# Altium schematic sheet LVBMSBQF schematic.SchDoc
size A4; SheetNumber: 1; SheetTotal: 3
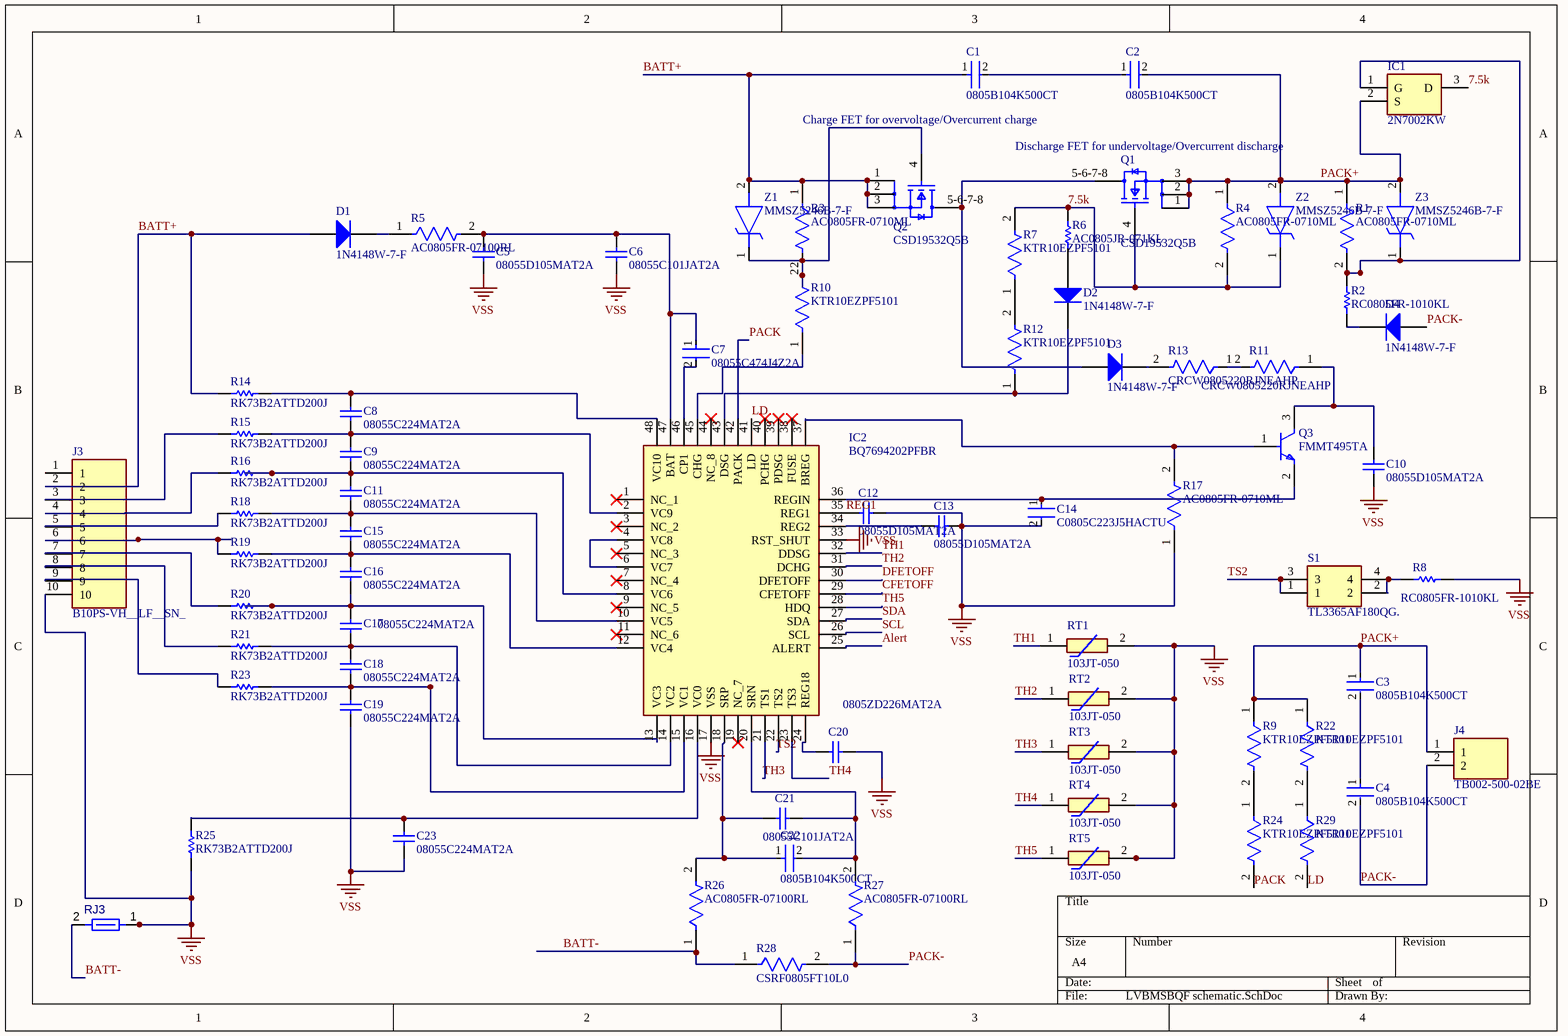
[diagram p0: LVBMSBQF schematic.SchDoc]

## Parts
C1  0805B104K500CT  [FP-0805B-IPC_C]
C2  0805B104K500CT  [FP-0805B-IPC_C]
C3  0805B104K500CT  [FP-0805B-IPC_C]
C4  0805B104K500CT  [FP-0805B-IPC_C]
C5  08055D105MAT2A  [CAPC2013X152X50ML20T25]
C6  08055C101JAT2A  [CAPC2013X94X50NL20T25]
C7  08055C474J4Z2A  [FP-0805-L_2_01_0_2-W_1_25-IPC_B]
C8  08055C224MAT2A  [CAPC2013X140X50NL20T25]
C9  08055C224MAT2A  [CAPC2013X140X50NL20T25]
C10  08055D105MAT2A  [CAPC2013X152X50ML20T25]
C11  08055C224MAT2A  [CAPC2013X140X50NL20T25]
C12  08055D105MAT2A  [CAPC2013X152X50ML20T25]
C13  08055D105MAT2A  [CAPC2013X152X50ML20T25]
C14  C0805C223J5HACTU  [FP-C0805C-DN-MFG]
C15  08055C224MAT2A  [CAPC2013X140X50NL20T25]
C16  08055C224MAT2A  [CAPC2013X140X50NL20T25]
C17  08055C224MAT2A  [CAPC2013X140X50NL20T25]
C18  08055C224MAT2A  [CAPC2013X140X50NL20T25]
C19  08055C224MAT2A  [CAPC2013X140X50NL20T25]
C20  0805ZD226MAT2A  [CAPC2013X152X50ML20T25]
C21  08055C101JAT2A  [CAPC2013X94X50NL20T25]
C22  0805B104K500CT  [FP-0805B-IPC_C]
C23  08055C224MAT2A  [CAPC2013X140X50NL20T25]
D1  1N4148W-7-F  [DIOD-SOD123-2_V]
D2  1N4148W-7-F  [DIOD-SOD123-2_V]
D3  1N4148W-7-F  [DIOD-SOD123-2_V]
D4  1N4148W-7-F  [DIOD-SOD123-2_V]
IC1  2N7002KW  [SOT65P210X110-3N]
IC2  BQ7694202PFBR  [QFP50P900X900X120-48N]
J3  B10PS-VH__LF__SN_  [B10PSVHLFSN]
J4  TB002-500-02BE  [TB00250002BE]
Q1  CSD19532Q5B  [FP-DNK0008A-MFG]
Q2  CSD19532Q5B  [FP-DNK0008A-MFG]
Q3  FMMT495TA  [FP-SOT23-MFG]
R1  AC0805FR-0710ML  [FP-AC0805-MFG]
R2  RC0805FR-1010KL  [RESC2013X60X35LL10T20]
R3  AC0805FR-0710ML  [FP-AC0805-MFG]
R4  AC0805FR-0710ML  [FP-AC0805-MFG]
R5  AC0805FR-07100RL  [FP-AC0805-MFG]
R6  AC0805JR-071KL  [RESC2013X60X35LL10T20]
R7  KTR10EZPF5101  [FP-KTR10-MFG]
R8  RC0805FR-1010KL  [RESC2013X60X35LL10T20]
R9  KTR10EZPF5101  [FP-KTR10-MFG]
R10  KTR10EZPF5101  [FP-KTR10-MFG]
R11  CRCW0805220RJNEAHP  [FP-CRCW0805-HPe3-IPC_A]
R12  KTR10EZPF5101  [FP-KTR10-MFG]
R13  CRCW0805220RJNEAHP  [FP-CRCW0805-HPe3-IPC_A]
R14  RK73B2ATTD200J  [RESC2013X60X30ML20T20]
R15  RK73B2ATTD200J  [RESC2013X60X30ML20T20]
R16  RK73B2ATTD200J  [RESC2013X60X30ML20T20]
R17  AC0805FR-0710ML  [FP-AC0805-MFG]
R18  RK73B2ATTD200J  [RESC2013X60X30ML20T20]
R19  RK73B2ATTD200J  [RESC2013X60X30ML20T20]
R20  RK73B2ATTD200J  [RESC2013X60X30ML20T20]
R21  RK73B2ATTD200J  [RESC2013X60X30ML20T20]
R22  KTR10EZPF5101  [FP-KTR10-MFG]
R23  RK73B2ATTD200J  [RESC2013X60X30ML20T20]
R24  KTR10EZPF5101  [FP-KTR10-MFG]
R25  RK73B2ATTD200J  [RESC2013X60X30ML20T20]
R26  AC0805FR-07100RL  [FP-AC0805-MFG]
R27  AC0805FR-07100RL  [FP-AC0805-MFG]
R28  CSRF0805FT10L0  [FP-CSRF0805-IPC_A]
R29  KTR10EZPF5101  [FP-KTR10-MFG]
RJ3  Net Tie 0.6x1.4mm  [SHORT10_8MIL-FP]  (value not drawn)  (net tie, no BOM)
RT1  103JT-050  [103JT050]
RT2  103JT-050  [103JT050]
RT3  103JT-050  [103JT050]
RT4  103JT-050  [103JT050]
RT5  103JT-050  [103JT050]
S1  TL3365AF180QG.  [TL3365AF180QG]
Z1  MMSZ5246B-7-F  [SOD3716X145N]
Z2  MMSZ5246B-7-F  [SOD3716X145N]
Z3  MMSZ5246B-7-F  [SOD3716X145N]

## Nets
VSS: C5.1 C6.1 C10.1 C12.2 C13.2 C14.2 C19.1 C20.2 C23.1 IC2.17(VSS) IC2.33(RST_SHUT) J3.10 R8.1 R17.1 R25.1 RJ3.1 RT1.2 RT2.2 RT3.2 RT4.2 RT5.2
7.5k: IC1.3(D) Q1.4(G) R4.2 R6.2 R7.2 Z2.1(K)
Alert: IC2.25(ALERT)
BATT+: C1.1 D1.1(A) J3.2 Q2.1(S) Q2.2(S) Q2.3(S) R3.1 R14.1 Z1.2(A)
BATT-: R26.1 R28.1 RJ3.2
CFETOFF: IC2.29(CFETOFF)
DFETOFF: IC2.30(DFETOFF)
LD: IC2.41(LD) R29.2
PACK: IC2.42(PACK) R24.2
PACK+: C2.2 C3.1 IC1.2(S) J4.1 Q1.1(S) Q1.2(S) Q1.3(S) R1.1 R4.1 R9.1 R22.1 Z2.2(A) Z3.2(A)
PACK-: C4.2 D4.1(A) J4.2 R27.1 R28.2
REG1: C12.1 IC2.35(REG1)
SCL: IC2.26(SCL)
SDA: IC2.27(SDA)
TH1: IC2.32(DDSG) RT1.1
TH2: IC2.31(DCHG) RT2.1
TH3: IC2.21(TS1) RT3.1
TH4: IC2.23(TS3) RT4.1
TH5: IC2.28(HDQ) RT5.1
TS2: IC2.22(TS2) S1.1 S1.3
NetC1_2: C1.2 C2.1
NetC3_2: C3.2 C4.1
NetC5_2: C5.2 C6.2 C7.1 IC2.47(BAT) R5.2
NetC7_2: C7.2 IC2.46(CP1)
NetC8_1: C8.1 C9.2 IC2.2(VC9) R15.2
NetC8_2: C8.2 IC2.48(VC10) R14.2
NetC10_2: C10.2 Q3.3(C) R11.1
NetC11_1: C11.1 C15.2 IC2.10(VC5) R18.2
NetC11_2: C11.2 IC2.8(VC6) R16.2
NetC13_1: C13.1 IC2.34(REG2)
NetC14_1: C14.1 IC2.36(REGIN) Q3.2(E)
NetC15_1: C15.1 C16.2 IC2.12(VC4) R19.2
NetC16_1: C16.1 C17.2 IC2.13(VC3) R20.2
NetC17_1: C17.1 C18.2 IC2.14(VC2) R21.2
NetC18_1: C18.1 C19.2 IC2.15(VC1) R23.2
NetC20_1: C20.1 IC2.24(REG18)
NetC21_1: C21.1 C22.2 IC2.20(SRN) R27.2
NetC21_2: C21.2 C22.1 IC2.18(SRP) R26.2
NetC23_2: C23.2 IC2.16(VC0) R25.2
NetD1_2: D1.2(K) R5.1
NetD2_1: D2.1(A) R6.1
NetD2_2: D2.2(K) IC2.43(DSG) R12.1
NetD3_1: D3.1(A) Q1.5-6-7-8(D) Q2.5-6-7-8(D)
NetD3_2: D3.2(K) R13.2
NetD4_2: D4.2(K) R2.2
NetIC1_1: IC1.1(G) R1.2 R2.1 Z3.1(K)
NetIC2_4: IC2.4(VC8) IC2.6(VC7)
NetIC2_37: IC2.37(BREG) Q3.1(B) R17.2
NetIC2_45: IC2.45(CHG) R10.1
NetJ3_3: J3.3 R15.1
NetJ3_4: J3.4 R16.1
NetJ3_5: J3.5 R18.1
NetJ3_6: J3.6 R19.1
NetJ3_7: J3.7 R20.1
NetJ3_8: J3.8 R21.1
NetJ3_9: J3.9 R23.1
NetQ2_4: Q2.4(G) R3.2 R10.2 Z1.1(K)
NetR7_1: R7.1 R12.2
NetR8_2: R8.2 S1.2 S1.4
NetR9_2: R9.2 R24.1
NetR11_2: R11.2 R13.1
NetR22_2: R22.2 R29.1

Not connected (* = marked no-connect by the designer): C9 1; IC2 1(NC_1)* 3(NC_2)* 5(NC_3)* 7(NC_4)* 9(NC_5)* 11(NC_6)* 19(NC_7)* 38(FUSE)* 39(PDSG)* 40(PCHG)* 44(NC_8)*; J3 1

## Notes on the sheet
- Charge FET for overvoltage/Overcurrent charge
- Discharge FET for undervoltage/Overcurrent discharge

## Library data of the parts
C1-C4 C22 = CMP-45632-000003-1: CAP CER 0.1UF 50V X7R 0805; Capacitance: 100nF; Tolerance: 10%; RoHS Compliant: Yes; Packaging: Tape and Reel; Voltage Rating (DC): 50V; Voltage Rating: 50V; Length: 2mm; Lead Free: Lead Free; Voltage: 50V; Case/Package: 0805; Case Code (Metric): 2012; Depth: 1.25mm; Min Operating Temperature: -55°C; Case Code (Imperial): 0805; Max Operating Temperature: 125°C; Radiation Hardening: No; Dielectric: X7R
C5 C10 C12 C13 = CMP-1036-04764-2
C6 C21 = CMP-2007-04356-1
C7 = CMP-04427-003155-1: Automotive Ceramic Capacitor, 0805, 470nF, 5%, X7R, 15%, 50V; Dielectric: X7R; Depth: 1.25mm; Max Operating Temperature: 125°C; Mount: Surface Mount; Radiation Hardening: No; Capacitance: 470nF; Construction: Flat; Packaging: Tape and Reel; Min Operating Temperature: -55°C; Length: 2.01mm; RoHS Compliant: Yes; Voltage Rating (DC): 50V; Case/Package: 0805; Tolerance: 5%; Package Quantity: 2000
C8 C9 C11 C15-C19 C23 = CMP-2007-04632-1
C14 = CMP-2007-03639-2: CAP CER 0.022UF 50V X8R 0805; Tolerance: 0.05; Capacitance: 22,000 pF; Material: Ceramic; Temperature Coefficient: 30ppm/°C; Value: 22,000 pF; ComponentLink2Description: Datasheet; Package: C0805C-DN; Category: Cap; Voltage Rating: 50 V; Lead Free: Yes; Height: 0.88mm; Temperature Characteristic: X8R; Mouser Description: Multilayer Ceramic Capacitors MLCC - SMD/SMT 50V 22000pF +/-5% X8R; Temperature Range High: +125°C; Ipc Land Pattern Name: CAPC200125X78; Automotive: No; Temperature: -55°C to +125°C; Temperature Range Low: -55°C; Octopart: https://octopart.com/c0805c223j5hactu-kemet-18638969; Device Class L1: Passive Components; RoHS: TRUE; Device Class L2: Capacitors; Device Class L3: Ceramic Capacitors; ComponentLink2URL: https://content.kemet.com/datasheets/KEM_C1003_C0G_SMD.pdf; Digikey Description: CAP CER 0.022UF 50V X8R 0805
C20 = CMP-2007-04522-1
D1-D4 = CMP-2000-04932-2: Fast Switching Diode, 100 V, 0.15 A, -65 to 150 degC, 2-Pin?SOD123, RoHS, Tape and Reel; Recovery Time: 4ns; Brand: DiodesIncorporated; Unit Weight: 0.000353oz; Max Surge Current: 2A; Peak Reverse Voltage: 100V; Ir - Reverse Current: 1uA; Vf - Forward Voltage: 1.25V; Configuration: Single; If - Forward Current: 0.15A; Product Category: Diodes-GeneralPurpose,Power,Switching; Operating Temperature Range: -65Cto+150C; Packaging: Reel; Manufacturer URL: http://www.diodes.com/; Maximum Operating Temperature: +150C; Height: 1.25mm; Minimum Operating Temperature: -65C; Product: SwitchingDiodes; Package URL: http://www.diodes.com/datasheets/ds18004.pdf; Type: SwitchingDiode; Package Reference: SOD123-2; Width: 1.7mm; Datasheet URL: http://www.farnell.com/datasheets/1915529.pdf; Datasheet Version: Rev. 24-2, 10/2013; Series: 1N4148; Factory Pack Quantity: 3000; Length: 2.85mm; RoHS: True; Mounting Style: SMD/SMT; Package / Case: SOD-123
  D4: Manufacturer: DiodesIncorporated
IC1 = 2N7002KW: Integrated Circuit; Manufacturer_Name: onsemi; Datasheet Link: https://www.onsemi.com/pub/Collateral/2N7002KW-D.PDF; Height: 1.1mm; Manufacturer_Part_Number: 2N7002KW; Mouser Part Number: 512-2N7002KW; Mouser Price/Stock: https://www.mouser.co.uk/ProductDetail/onsemi-Fairchild/2N7002KW?qs=1%252BQrTMB6OPVOqkaNo2cdQQ%3D%3D; Arrow Part Number: 2N7002KW; Arrow Price/Stock: https://www.arrow.com/en/products/2n7002kw/on-semiconductor.html?utm_currency=USD&region=nac
IC2 = BQ7694202PFBR: Integrated Circuit; Datasheet Link: https://www.ti.com/lit/ds/symlink/bq76942.pdf?ts=1642500793238&ref_url=https%253A%252F%252Fwww.ti.com%252Fproduct%252FBQ76942; Height: 1.2mm; Manufacturer_Part_Number: BQ7694202PFBR; Mouser Part Number: 595-BQ7694202PFBR; Mouser Price/Stock: https://www.mouser.co.uk/ProductDetail/Texas-Instruments/BQ7694202PFBR?qs=iLbezkQI%252BshAVl2BMDVCMQ%3D%3D; Arrow Part Number: BQ7694202PFBR; Arrow Price/Stock: https://www.arrow.com/en/products/bq7694202pfbr/texas-instruments?utm_currency=USD&region=nac
J3 = B10PS-VH__LF__SN_: Connector; Manufacturer_Part_Number: B10PS-VH (LF)(SN); Datasheet Link: https://www.marutsu.co.jp/contents/shop/marutsu/datasheet/VH.pdf; Height: 8.5mm; Arrow Part Number: B10PS-VH (LF)(SN); Arrow Price/Stock: https://www.arrow.com/en/products/b10ps-vh-lf-sn/jst-manufacturing?region=nac
J4 = TB002-500-02BE: Connector; Manufacturer_Name: Same Sky; Datasheet Link: https://www.sameskydevices.com/product/resource/tb002-500.pdf; Height: 10.4mm; Manufacturer_Part_Number: TB002-500-02BE; Mouser Part Number: 490-TB002-500-02BE; Mouser Price/Stock: https://www.mouser.co.uk/ProductDetail/Same-Sky/TB002-500-02BE?qs=vLWxofP3U2x9716kcgva%2Fw%3D%3D; Arrow Part Number: TB002-500-02BE; Arrow Price/Stock: https://www.arrow.com/en/products/tb002-500-02be/cui-devices.html?utm_currency=USD&region=nac
Q1 Q2 = CMP-04962-000007-1: MOSFET N-CH 100V 100A 8SON; Depletion Mode: False; Number Of Channels: 1; Gate To Source Voltage: 20V; Reverse Recovery Time: 80ns; Input Capacitace At Vds: 3700pF @ 50V; Max Forward Diode Voltage: 1V; Turn Off Delay Time: 22ns; Drain To Source Resistance: 4.6mΩ; Threshold Vgs Max: 3.2V; Max Junction Temp: +150°C; Turn On Delay Time: 7ns; Pulse Drain Current: 400A; Rthja Max: 50°C/W; Typ Forward Diode Voltage: 0.8V; Reverse Recovery Charge: 249nC; Threshold Vgs Min: 2.2V; Gate Charge At Vgs: 48nC @ 10V; Power Dissipation: 3.1W; Transconductance: 84S; Temperature Range Low: -55°C; Automotive: No; RoHS: TRUE; Temperature: -55°C to +150°C; Device Class L3: MOSFETs; Continuous Drain Current: 100A; Number Of N Channels: 1; Height: 1.05mm; Mouser Description: MOSFET 100V 4.0 mOhm N-Ch NexFET Power MOSFET; Drain To Source Voltage: 100V; Temperature Range High: +150°C; Octopart: https://octopart.com/csd19532q5b-texas+instruments-32890191; ComponentLink2URL: http://www.ti.com/lit/ds/symlink/csd19532q5b.pdf; Lead Free: Yes; Drain To Source Breakdown Voltage: 100V; Device Class L1: Discrete Semiconductors; Device Class L2: Transistors; Package: DNK0008A; Digikey Description: MOSFET N-CH 100V 100A 8SON; Category: Trans; ComponentLink2Description: Datasheet
Q3 = CMP-12798-000005-1: TRANS NPN 150V 1A SOT23-3; Hfe Max: 300; Power Dissipation: 500mW; Unity Gain Freq: 100MHz; Collector Emitter Saturation Voltage: 0.3V; Number Of Elements: 1; Collector Base Voltage: 170V; Hfe Min: 100; Automotive Grade: Grade 0; Hfe Testvce: 10V; Max Junction Temp: +150°C; Rthja Max: 250°C/W; Hfe Testic: 250mA; Standoff Height: 0.013mm; Emitter Base Voltage: 7V; ComponentLink2Description: Datasheet; Package: SOT23; Device Class L2: Transistors; Lead Free: Yes; Height: 1.1mm; Automotive: Yes; Digikey Description: TRANS NPN 150V 1A SOT23-3; Max Collector Current: 1A; Mouser Description: Bipolar Transistors - BJT NPN High Voltage; Collector Emitter Voltage: 150V; Footprint Url: https://www.diodes.com/assets/Package-Files/SOT23.pdf; ComponentLink2URL: https://www.diodes.com/assets/Datasheets/FMMT495.pdf; Temperature: -55°C to +150°C; Number Of Npn: 1; RoHS: TRUE; Collector Emitter Breakdown Voltage: 150V; Category: Trans; Device Class L3: BJTs; Octopart: https://octopart.com/fmmt495ta-diodes+inc.-356348; Device Class L1: Discrete Semiconductors; Temperature Range High: +150°C; Temperature Range Low: -55°C
R1 R3 R4 R17 = CMP-03412-037628-1: RES SMD 10M OHM 1% 1/8W 0805; Automotive Grade: Grade 0; Voltage Rating: 150V; Value: 10MΩ; Tolerance: 0.01; Device Class L2: Resistors; Device Class L3: Chip SMD Resistors; Package: AC0805; Lead Free: Yes; Series: AC; Automotive: Yes; Composition: Thick Film; Temperature: -55°C to +155°C; Resistance: 10MΩ; Octopart: https://octopart.com/ac0805fr-0710ml-yageo-71367525; Height: 0.6mm; Power Rating: 1/8W; Temperature Range Low: -55°C; Category: Res; Ipc Land Pattern Name: RESC200125X50; Digikey Description: RES SMD 10M OHM 1% 1/8W 0805; Device Class L1: Passive Components; RoHS: TRUE; ComponentLink2URL: http://www.yageo.com/documents/recent/PYu-AC_51_RoHS_L_6.pdf; ComponentLink2Description: Datasheet; Footprint Url: http://www.yageo.com/exep/pages/download/literatures/PYu-R_Mount_10.pdf; Temperature Range High: +155°C
R2 R8 = CMP-2001-04512-1
R5 R26 R27 = CMP-03412-037503-1: Res Thick Film 0805 100 Ohm 1% 1/8W ±100ppm/°C Molded SMD Paper T/R; Voltage Rating: 150V; Tolerance: 0.01; Automotive Grade: Grade 0; Resistance: 100Ω; Value: 100Ω; Package: AC0805; ComponentLink2URL: http://www.yageo.com/documents/recent/PYu-AC_51_RoHS_L_6.pdf; Device Class L2: Resistors; Mouser Description: Thick Film Resistors 1/8W 100ohm 1% AEC-Q200; Footprint Url: http://www.yageo.com/exep/pages/download/literatures/PYu-R_Mount_10.pdf; Temperature Range Low: -55°C; Temperature: -55°C to +155°C; ComponentLink2Description: Datasheet; RoHS: TRUE; Category: Res; Ipc Land Pattern Name: RESC200125X50; Temperature Range High: +155°C; Composition: Thick Film; Octopart: https://octopart.com/ac0805fr-07100rl-yageo-24517276; Device Class L3: Chip SMD Resistors; Height: 0.6mm; Automotive: Yes; Digikey Description: Res Thick Film 0805 100 Ohm 1% 1/8W ±100ppm/°C Molded SMD Paper T/R; Series: AC; Lead Free: Yes; Power Rating: 1/8W; Device Class L1: Passive Components
R6 = CMP-2001-04511-1
R7 R9 R10 R12 R22 R24 R29 = CMP-08839-031572-1: Res Thick Film 0805 5.1kΩ 1% 0.125W ±100ppm/°C Automotive Paper T/R; Max Power Dissipation: 125mW; Resistance: 5.1kR; Number of Terminations: 2; Features: Automotive AEC-Q200; Height: 0.026inch; Length: 0.079inch; Case/Package: 0805; Packaging: Tape and Reel; Case Code (Imperial): 0805; Min Operating Temperature: -55°C; Tolerance: 1%; Width: 0.049inch; Max Operating Temperature: 155°C; Resistor Type: Thick Film; Temperature Coefficient: 100ppm/°C; Series: KTR; Package Quantity: 5000; Case Code (Metric): 2012; RoHS Compliant: Yes
R11 R13 = CMP-02407-005533-1: RES Thick Film, 220Ω, 5%, 0.5W, 200ppm/°C, 0805; Power Rating: 500mW; Resistance: 220R; Voltage Rating: 150V; Max Power Dissipation: 333mW; Max Operating Temperature: 155°C; Tolerance: 5%; Features: Automotive AEC-Q200; Case Code (Imperial): 0805; Height: 0.024inch; Length: 0.079inch; Lead Free: Lead Free; Case Code (Metric): 2012; Temperature Coefficient: 200ppm/°C; Packaging: Tape and Reel; Case/Package: 0805; Package Quantity: 1; Contact Plating: Tin; Radiation Hardening: No; Number of Terminations: 2; Termination: SMD/SMT; Weight: 0.000194oz; Width: 0.049inch; Min Operating Temperature: -55°C; Composition: Thick Film
R14-R16 R18-R21 R23 R25 = CMP-2001-01797-1
R28 = CMP-26527-002472-1: Foil on Ceramic Current Sensing Chip Resistor 10 mΩ ±1% 0.5W 0805 AEC Qualified; Temperature Coefficient: 100ppm/°C; Max Power Dissipation: 500mW; Resistance: 10mR; Max Operating Temperature: 170°C; RoHS Compliant: Yes; Number of Terminations: 2; Case/Package: 0805; Radiation Hardening: No; Series: CSRF; Height: 0.031inch; Lead Free: Lead Free; Length: 0.079inch; Min Operating Temperature: -55°C; Case Code (Imperial): 0805; Resistor Type: Metal Foil; Features: Moisture Resistant; Mount: Surface Mount; Contact Plating: Tin; Tolerance: 1%; Width: 0.049inch; Case Code (Metric): 2012; Packaging: Tape and Reel
RJ3 = CMP-009-00120-2: Max Operating Temperature: 155°C; Min Operating Temperature: -55°C; Pins: 2
RT1-RT5 = 103JT-050: Thermistor; Manufacturer_Name: Semitec; Datasheet Link: https://componentsearchengine.com/Datasheets/1/103JT-050.pdf; Height: 46mm; Manufacturer_Part_Number: 103JT-050; Mouser Part Number: 954-103JT-050; Mouser Price/Stock: https://www.mouser.co.uk/ProductDetail/Semitec/103JT-050?qs=wgO0AD0o1vtVkR4pf7Ll0w%3D%3D
S1 = TL3365AF180QG.: Switch; Datasheet Link: https://sten-eswitch-13110800-production.s3.amazonaws.com/system/asset/product_line/data_sheet/218/TL3365.pdf; Height: 2.5mm; Manufacturer_Part_Number: TL3365AF180QG.
Z1-Z3 = MMSZ5246B-7-F: Zener Diode; Datasheet Link: https://www.diodes.com//assets/Datasheets/ds18010.pdf; Height: 1.45mm; Manufacturer_Part_Number: MMSZ5246B-7-F; Mouser Part Number: 621-MMSZ5246B-F; Mouser Price/Stock: https://www.mouser.co.uk/ProductDetail/Diodes-Incorporated/MMSZ5246B-7-F?qs=YL8BMuhSknSfmeWTDXIh1Q%3D%3D; Arrow Part Number: MMSZ5246B-7-F; Arrow Price/Stock: https://www.arrow.com/en/products/mmsz5246b-7-f/diodes-incorporated?region=europe